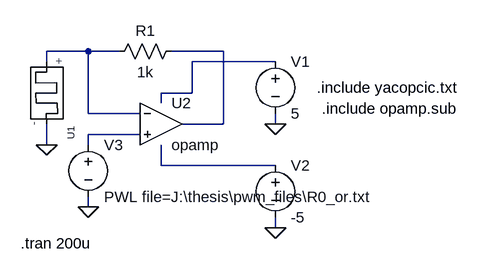
[diagram p0: schematic programmer.asc]
programmer.asc, the LTspice schematic file:
Version 4
SHEET 1 976 680
WIRE 352 64 288 64
WIRE 400 64 352 64
WIRE 560 64 480 64
WIRE 288 80 288 64
WIRE 640 80 512 80
WIRE 512 128 512 80
WIRE 512 128 464 128
WIRE 464 144 464 128
WIRE 352 160 352 64
WIRE 432 160 352 160
WIRE 560 176 560 64
WIRE 560 176 496 176
WIRE 640 176 640 160
WIRE 432 192 352 192
WIRE 288 208 288 176
WIRE 352 208 352 192
WIRE 464 240 464 208
WIRE 640 240 464 240
WIRE 352 304 352 288
WIRE 640 336 640 320
FLAG 288 208 0
FLAG 640 176 0
FLAG 640 336 0
FLAG 352 304 0
SYMBOL memristormodel 288 160 R90
SYMATTR InstName U1
SYMATTR Value MEM_YAKOPCIC
SYMBOL res 496 48 R90
WINDOW 0 0 56 VBottom 2
WINDOW 3 32 56 VTop 2
SYMATTR InstName R1
SYMATTR Value 1k
SYMBOL voltage 640 64 R0
WINDOW 123 0 0 Left 2
WINDOW 39 0 0 Left 2
SYMATTR InstName V1
SYMATTR Value 5
SYMBOL voltage 640 224 R0
WINDOW 123 0 0 Left 2
WINDOW 39 0 0 Left 2
SYMATTR InstName V2
SYMATTR Value -5
SYMBOL voltage 352 192 R0
WINDOW 123 0 0 Left 2
WINDOW 39 0 0 Left 2
SYMATTR InstName V3
SYMATTR Value PWL file=J:\thesis\pwm_files\R0_or.txt
SYMBOL Opamps\\opamp 464 112 R0
SYMATTR InstName U2
TEXT 704 120 Left 2 !.include yacopcic.txt
TEXT 248 360 Left 2 !.tran 200u
TEXT 712 152 Left 2 !.include opamp.sub

The netlist it stands for:
* programmer.asc
XU1 N001 0 M MEM_YAKOPCIC  ; pins + -
R1 N002 N001 1k
V1 N003 0 5
V2 N005 0 -5
V3 N004 0 PWL file=J:\thesis\pwm_files\R0_or.txt
XU2 N001 N004 N002 opamp Aol=100K GBW=10Meg  ; pins invin noninvin out
.include yacopcic.txt
.tran 200u
.include opamp.sub
.backanno
.end